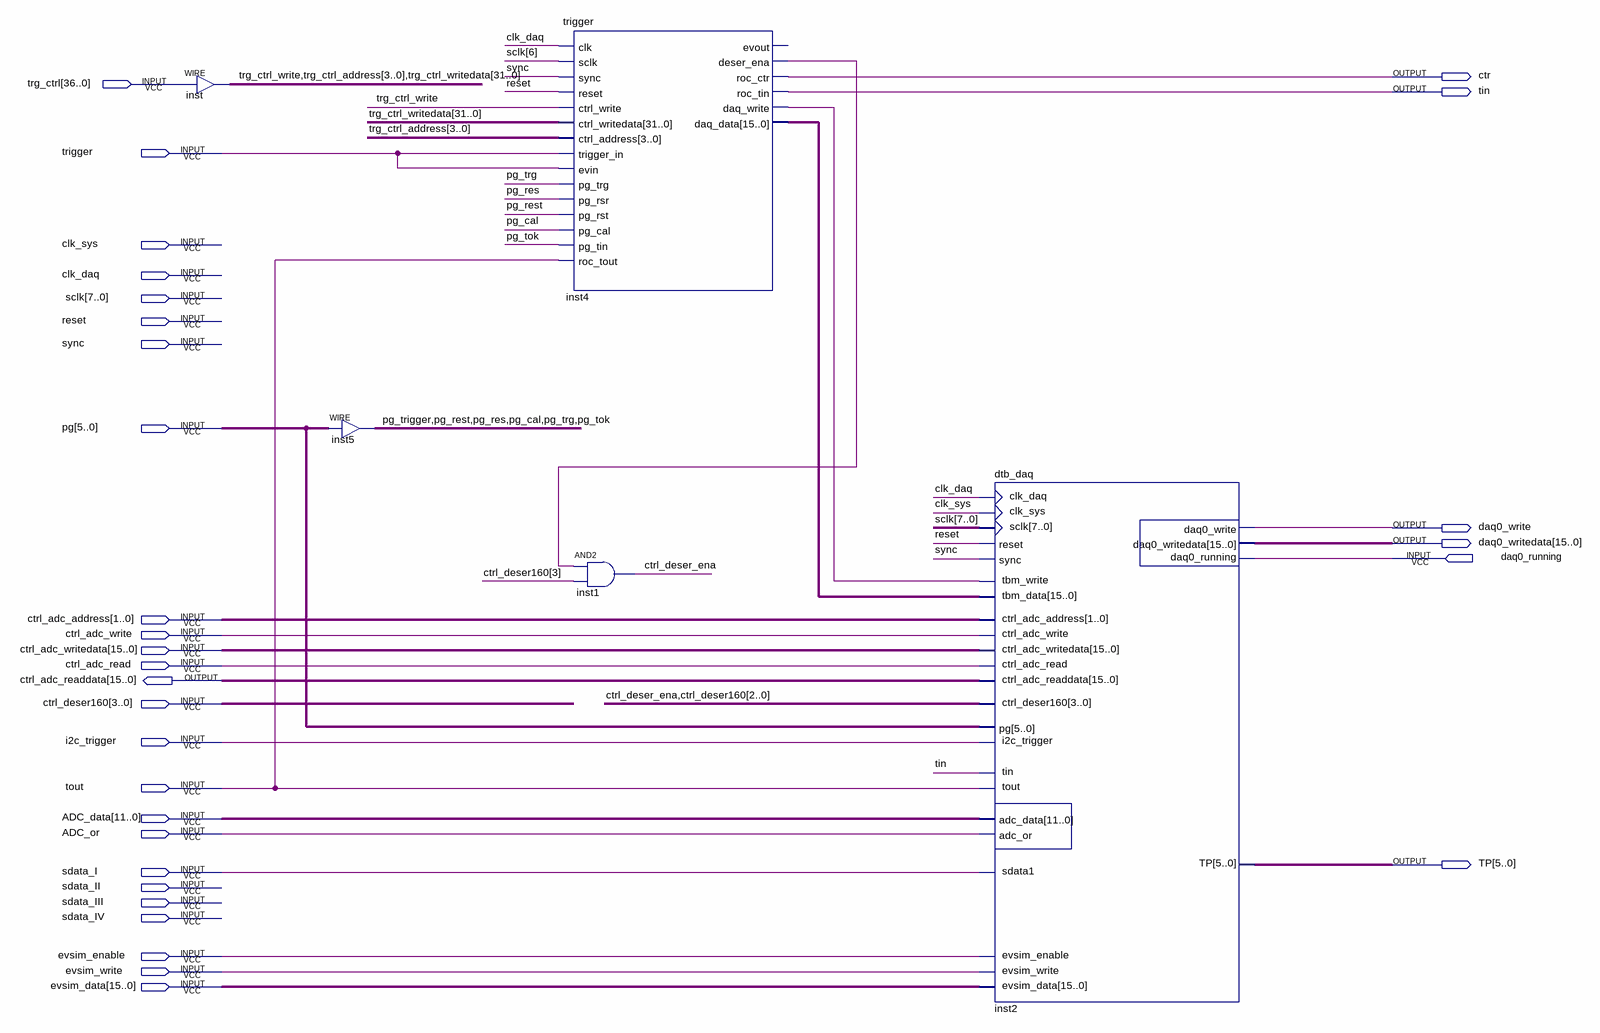
[diagram p0: schematic sheet]
// Quartus schematic data_aqu.bdf as structural Verilog: 5 symbols, 31 pins
module data_aqu (
  input  [36:0] trg_ctrl,
  input  trigger,
  input  clk_sys,
  input  clk_daq,
  input  [7:0] sclk,
  input  reset,
  input  sync,
  input  [5:0] pg,
  input  daq0_running,
  input  [1:0] ctrl_adc_address,
  input  ctrl_adc_write,
  input  [15:0] ctrl_adc_writedata,
  input  ctrl_adc_read,
  input  [3:0] ctrl_deser160,
  input  i2c_trigger,
  input  tout,
  input  [11:0] ADC_data,
  input  ADC_or,
  input  sdata_I,
  input  sdata_II,
  input  sdata_III,
  input  sdata_IV,
  input  evsim_enable,
  input  evsim_write,
  input  [15:0] evsim_data,
  output ctr,
  output tin,
  output daq0_write,
  output [15:0] daq0_writedata,
  output [15:0] ctrl_adc_readdata,
  output [5:0] TP
);

  wire ctrl_deser_ena, inst4_daq_write, inst4_deser_ena, pg_cal, pg_res, pg_rest, pg_tok, pg_trg, pg_trigger,
       trg_ctrl_write;
  wire [3:0] trg_ctrl_address;
  wire [15:0] inst4_daq_data;
  wire [31:0] trg_ctrl_writedata;

  assign {trg_ctrl_write, trg_ctrl_address, trg_ctrl_writedata} = trg_ctrl;  // WIRE inst
  assign {pg_trigger, pg_rest, pg_res, pg_cal, pg_trg, pg_tok} = pg;  // WIRE inst5
  trigger inst4 (
    .clk(clk_daq), .sclk(sclk[6]), .sync(sync), .reset(reset), .ctrl_write(trg_ctrl_write),
    .ctrl_writedata(trg_ctrl_writedata), .ctrl_address(trg_ctrl_address), .trigger_in(trigger),
    .evin(trigger), .pg_trg(pg_trg), .pg_rsr(pg_res), .pg_rst(pg_rest), .pg_cal(pg_cal), .pg_tin(pg_tok),
    .roc_tout(tout), .deser_ena(inst4_deser_ena), .roc_ctr(ctr), .roc_tin(tin), .daq_write(inst4_daq_write),
    .daq_data(inst4_daq_data));  // open: evout
  and inst1 (ctrl_deser_ena, inst4_deser_ena, ctrl_deser160[3]);
  dtb_daq inst2 (
    .clk_daq(clk_daq), .clk_sys(clk_sys), .reset(reset), .sync(sync), .pg(pg), .adc_data(ADC_data),
    .adc_or(ADC_or), .tin(tin), .tout(tout), .sdata1(sdata_I),
    .ctrl_deser160({ctrl_deser_ena, ctrl_deser160[2:0]}), .sclk(sclk), .daq0_running(daq0_running),
    .ctrl_adc_address(ctrl_adc_address), .ctrl_adc_write(ctrl_adc_write), .ctrl_adc_read(ctrl_adc_read),
    .ctrl_adc_writedata(ctrl_adc_writedata), .i2c_trigger(i2c_trigger), .evsim_data(evsim_data),
    .evsim_write(evsim_write), .evsim_enable(evsim_enable), .tbm_write(inst4_daq_write),
    .tbm_data(inst4_daq_data), .daq0_write(daq0_write), .daq0_writedata(daq0_writedata),
    .ctrl_adc_readdata(ctrl_adc_readdata), .TP(TP));
endmodule
